# Altium schematic sheet Schematic File.SchDoc
size A4
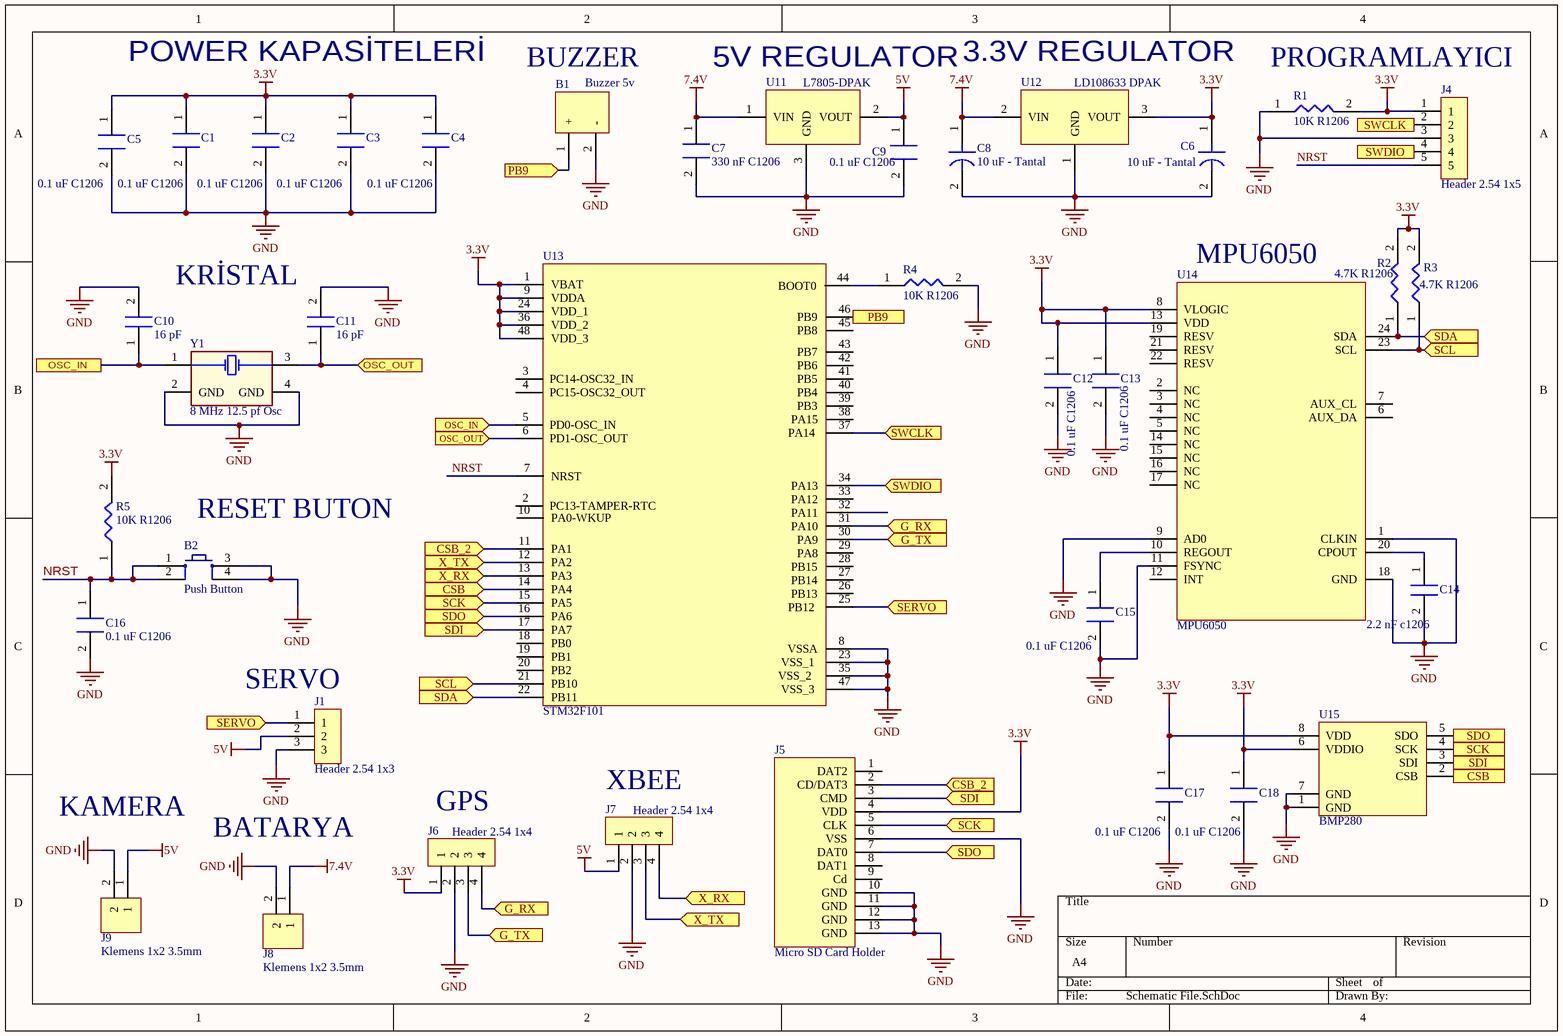
[diagram p0: Schematic File.SchDoc]

## Parts
B1  Buzzer 5v  [Buzzer 5v]
B2  Push Button  [PUSB BUTTON-SMD]
C1  0.1 uF C1206  [C1206]
C2  0.1 uF C1206  [C1206]
C3  0.1 uF C1206  [C1206]
C4  0.1 uF C1206  [C1206]
C5  0.1 uF C1206  [C1206]
C6  10 uF - Tantal  [C1206- TANTAL]
C7  330 nF C1206  [C1206]
C8  10 uF - Tantal  [C1206- TANTAL]
C9  0.1 uF C1206  [C1206]
C10  16 pF  [C1206]
C11  16 pF  [C1206]
C12  0.1 uF C1206  [C1206]
C13  0.1 uF C1206  [C1206]
C14  2.2 nF c1206  [C1206]
C15  0.1 uF C1206  [C1206]
C16  0.1 uF C1206  [C1206]
C17  0.1 uF C1206  [C1206]
C18  0.1 uF C1206  [C1206]
J1  Header 2.54 1x3  [Header 2.54 1x3]
J4  Header 2.54 1x5  [Header 2.54 1x5]
J5  Micro SD Card Holder  [Micro SD Card Holder]
J6  Header 2.54 1x4  [Header 2.54 1x4]
J7  Header 2.54 1x4  [Header 2.54 1x4]
J8  Klemens 1x2 3.5mm  [Klemens 1x2 - 3.5mm]
J9  Klemens 1x2 3.5mm  [Klemens 1x2 - 3.5mm]
R1  10K R1206  [R1206 Resıstor]
R2  4.7K R1206  [R1206 Resıstor]
R3  4.7K R1206  [R1206 Resıstor]
R4  10K R1206  [R1206 Resıstor]
R5  10K R1206  [R1206 Resıstor]
U11  L7805-DPAK  [DPAK228P972X230-3N]
U12  LD108633 DPAK  [DPAK228P972X230-3N]
U13  STM32F101  [LQFP48-STM]
U14  MPU6050  [QFN50P400X400X90_HS-25N]
U15  BMP280  [BMP280]
Y1  8 MHz 12.5 pf Osc  [8 MHZ Osc.]

## Ports
CSB (in), CSB_2 (in), G_RX (in), G_TX (in), OSC_IN (in), OSC_OUT (in), PB9 (in), SCK (in), SCL (in), SDA (in), SDI (in), SDO (in), SERVO (in), SWCLK (in), SWDIO (in), X_RX (in), X_TX (in)

## Nets
3.3V: C1.1 C2.1 C3.1 C4.1 C5.1 C6.1 C12.1 C13.1 C17.1 C18.1 J4.1 J5.4(VDD) J6.1 R1.2 R2.2 R3.2 R5.2 U12.3(VOUT) U13.1(VBAT) U13.9(VDDA) U13.24(VDD_1) U13.36(VDD_2) U13.48(VDD_3) U14.8(VLOGIC) U14.13(VDD) U15.6(VDDIO) U15.8(VDD)
5V: C9.1 J1.2 J7.1 J9.1 U11.2(VOUT)
7.4V: C7.1 C8.1 J8.1 U11.1(VIN) U12.2(VIN)
GND: B1.2(-) B2.3 B2.4 C1.2 C2.2 C3.2 C4.2 C5.2 C6.2 C7.2 C8.2 C9.2 C10.2 C11.2 C12.2 C13.2 C14.2 C15.2 C16.2 C17.2 C18.2 J1.3 J4.3 J5.6(VSS) J5.10(GND) J5.11(GND) J5.12(GND) J5.13(GND) J6.2 J7.2 J8.2 J9.2 R1.1 R4.2 U11.3(GND) U12.1(GND) U13.8(VSSA) U13.23(VSS_1) U13.35(VSS_2) U13.47(VSS_3) U14.1(CLKIN) U14.9(AD0) U14.11(FSYNC) U14.18(GND) U15.1(GND) U15.7(GND) Y1.2(GND) Y1.4(GND)
CSB: U13.14(PA4) U15.2(CSB) ; port CSB
CSB_2: J5.2(CD/DAT3) U13.11(PA1) ; port CSB_2
G_RX: J6.4 U13.31(PA10) ; port G_RX
G_TX: J6.3 U13.30(PA9) ; port G_TX
NRST: B2.1 B2.2 C16.1 J4.5 R5.1 U13.7(NRST)
OSC_IN: C10.1 U13.5(PD0-OSC_IN) Y1.1 ; port OSC_IN
OSC_OUT: C11.1 U13.6(PD1-OSC_OUT) Y1.3 ; port OSC_OUT
PB9: B1.1(+) U13.46(PB9) ; port PB9
SCK: J5.5(CLK) U13.15(PA5) U15.4(SCK) ; port SCK
SCL: R3.1 U13.21(PB10) U14.23(SCL) ; port SCL
SDA: R2.1 U13.22(PB11) U14.24(SDA) ; port SDA
SDI: J5.3(CMD) U13.17(PA7) U15.3(SDI) ; port SDI
SDO: J5.7(DAT0) U13.16(PA6) U15.5(SDO) ; port SDO
SERVO: J1.1 U13.25(PB12) ; port SERVO
SWCLK: J4.2 U13.37(PA14) ; port SWCLK
SWDIO: J4.4 U13.34(PA13) ; port SWDIO
X_RX: J7.4 U13.13(PA3) ; port X_RX
X_TX: J7.3 U13.12(PA2) ; port X_TX
NetC14_1: C14.1 U14.20(CPOUT)
NetC15_1: C15.1 U14.10(REGOUT)
NetR4_1: R4.1 U13.44(BOOT0)

Not connected (* = marked no-connect by the designer): J5 1(DAT2) 8(DAT1) 9(Cd); U13 2(PC13-TAMPER-RTC) 3(PC14-OSC32_IN) 4(PC15-OSC32_OUT) 10(PA0-WKUP) 18(PB0) 19(PB1) 20(PB2) 26(PB13) 27(PB14) 28(PB15) 29(PA8) 32(PA11) 33(PA12) 38(PA15) 39(PB3) 40(PB4) 41(PB5) 42(PB6) 43(PB7) 45(PB8); U14 2(NC) 3(NC) 4(NC) 5(NC) 6(AUX_DA) 7(AUX_CL) 12(INT) 14(NC) 15(NC) 16(NC) 17(NC) 19(RESV) 21(RESV) 22(RESV)

## Notes on the sheet
- POWER KAPASİTELERİ
- BUZZER
- (near U11) 5V REGULATOR
- 3.3V REGULATOR
- PROGRAMLAYICI
- KRİSTAL
- (near U14) MPU6050
- (near B2) RESET BUTON
- (near J1) SERVO
- KAMERA
- BATARYA
- (near J6) GPS
- XBEE

## Library data of the parts
B2 = Push Button: Smd Push Button; Satın Alma Linki: https://urun.n11.com/diger/mini-pushbutton-switch-smd-P227461537?gclid=Cj0KCQjwkoDmBRCcARIsAG3xzl8Y_-jeD7HocNM6lvuZ_rVp83568XPGtNzlPwXWLph8oCRqo0yh87UaApZYEALw_wcB&gclsrc=aw.ds
U11 = L7805-DPAK: L7805 5V REGULATOR. SMD PAKET
U12 = LD108633 DPAK: LD1086 3.3V REGULATOR
U13 = STM32F101: STM32F101 48 PİNLİ MİKROİŞLEMCİ
U14 = MPU6050: MPU6050 GYRO
U15 = BMP280: BMP280 SENSOR